# EAGLE design CX80 (EAGLE 6.3)
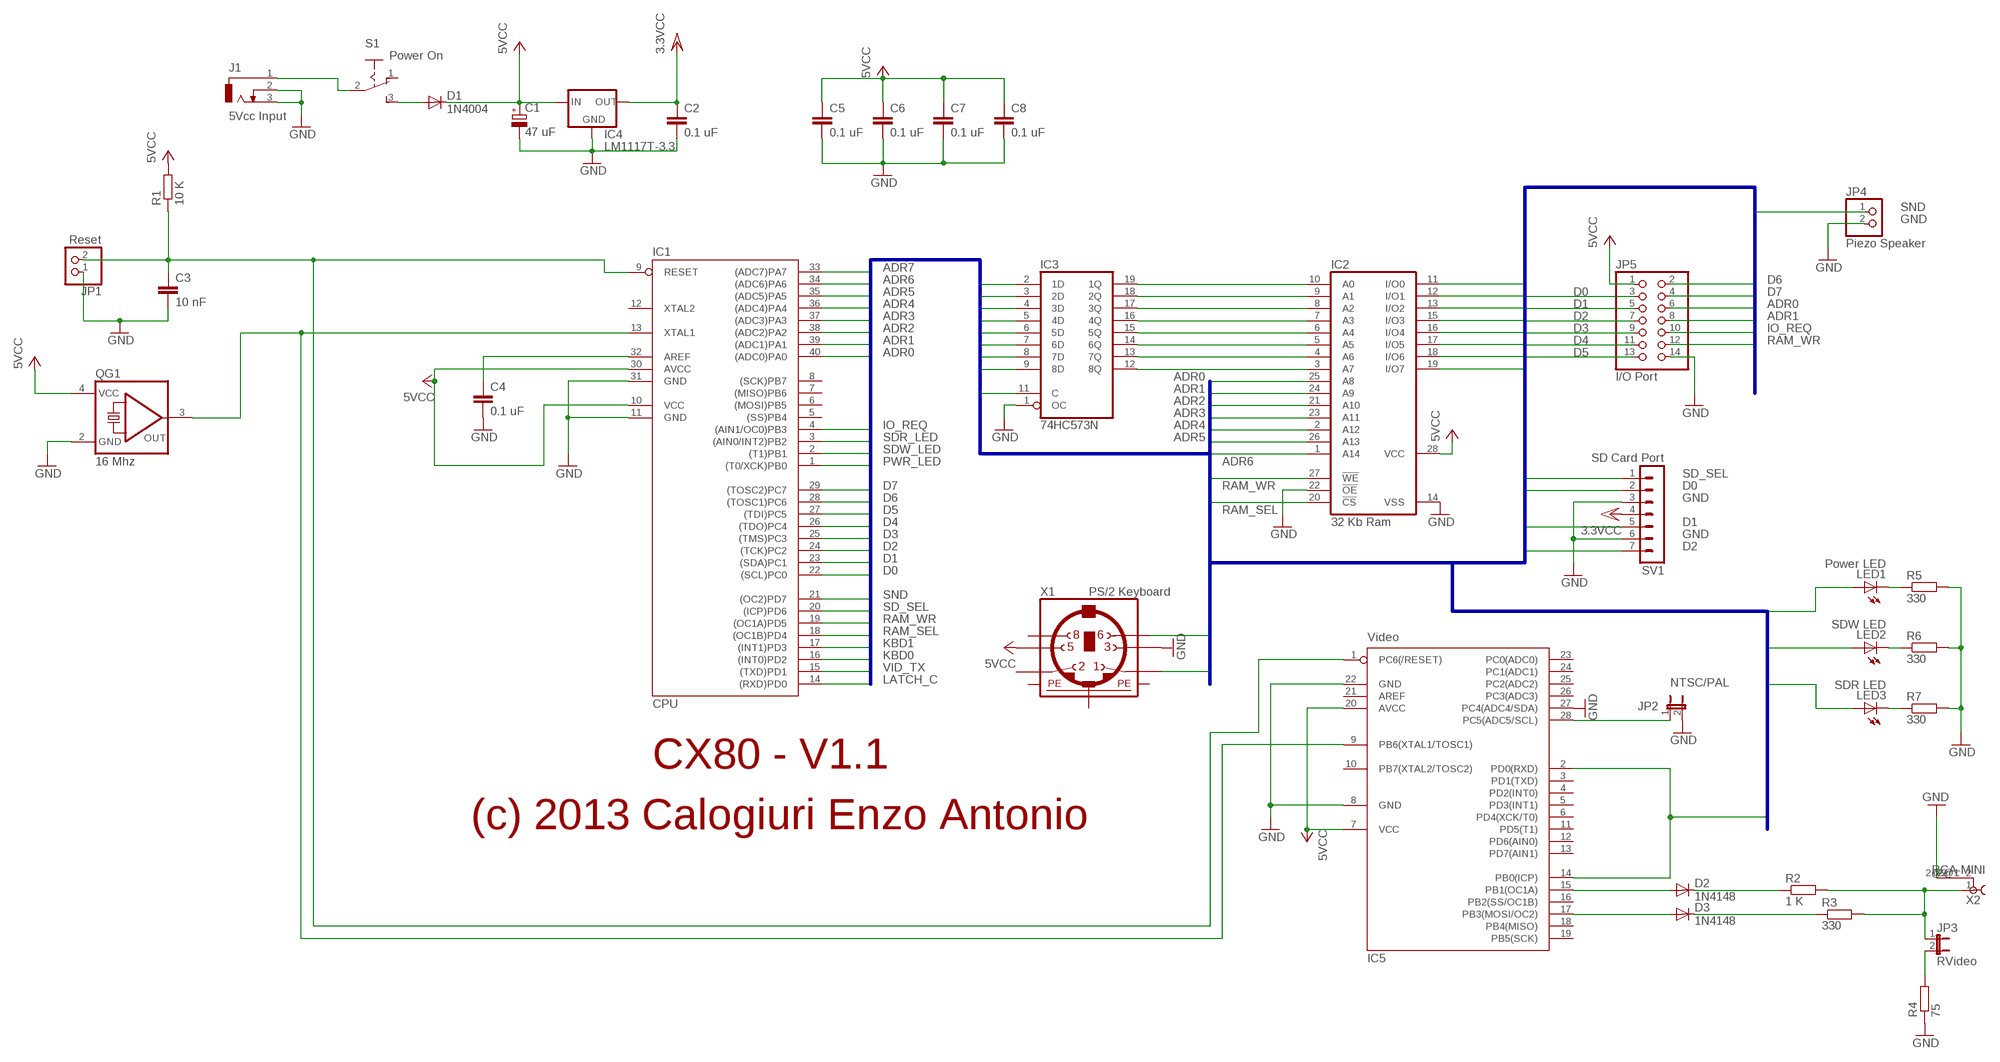
[diagram p0: schematic, sheet 1]

## Parts
C1  47 uF  CPOL-EUE2.5-5  [E2,5-5]
C2  0.1 uF  C-EU050-030X075  [C050-030X075]
C3  10 nF  C-EU050-030X075  [C050-030X075]
C4  0.1 uF  C-EU050-030X075  [C050-030X075]
C5  0.1 uF  C-EU050-030X075  [C050-030X075]
C6  0.1 uF  C-EU050-030X075  [C050-030X075]
C7  0.1 uF  C-EU050-030X075  [C050-030X075]
C8  0.1 uF  C-EU050-030X075  [C050-030X075]
D1  1N4004  [DO41-10]
D2  1N4148  1N4148DO35-10  [DO35-10]
D3  1N4148  1N4148DO35-10  [DO35-10]
IC1  CPU  MEGA32-P  [DIL40]
IC2  32 Kb Ram  62832P  [DIL28-3]
IC3  74HC573N  [DIL20]
IC4  LM1117T-3.3  [TO220]
IC5  Video  MEGA8-P  [DIL28-3]
J1  5Vcc Input  DCJ0303  [DCJ0303]
JP1  Reset  PINHD-1X2  [1X02]
JP2  NTSC/PAL  JP1E  [JP1]
JP3  RVideo  JP1E  [JP1]
JP4  Piezo Speaker  PINHD-1X2  [1X02]
JP5  I/O Port  PINHD-2X7  [2X07]
LED1  Power LED  LED3MM  [LED3MM]
LED2  SDW LED  LED3MM  [LED3MM]
LED3  SDR LED  LED3MM  [LED3MM]
QG1  16 Mhz  SG531  [DIL08-4]
R1  10 K  R-EU_0207/10  [0207/10]
R2  1 K  R-EU_0207/10  [0207/10]
R3  330  R-EU_0207/10  [0207/10]
R4  75  R-EU_0207/10  [0207/10]
R5  330  R-EU_0207/10  [0207/10]
R6  330  R-EU_0207/10  [0207/10]
R7  330  R-EU_0207/10  [0207/10]
S1  Power On  255SB  [255SB]
SV1  SD Card Port  MA07-1  [MA07-1]
X1  PS/2 Keyboard  MINI_DIN_6  [M_DIN6]
X2  RCA-MINI  [RCA-MINI]

## Nets
ADR0: IC1.40((ADC0)PA0) IC2.25(A8) IC3.2(1D) JP5.6
ADR1: IC1.39((ADC1)PA1) IC2.24(A9) IC3.3(2D) JP5.8
ADR2: IC1.38((ADC2)PA2) IC2.21(A10) IC3.4(3D)
ADR3: IC1.37((ADC3)PA3) IC2.23(A11) IC3.5(4D)
ADR4: IC1.36((ADC4)PA4) IC2.2(A12) IC3.6(5D)
ADR5: IC1.35((ADC5)PA5) IC2.26(A13) IC3.7(6D)
ADR6: IC1.34((ADC6)PA6) IC2.1(A14) IC3.8(7D)
ADR7: IC1.33((ADC7)PA7) IC3.9(8D)
D0: IC1.22((SCL)PC0) IC2.11(I/O0) JP5.3 SV1.2
D1: IC1.23((SDA)PC1) IC2.12(I/O1) JP5.5 SV1.5
D2: IC1.24((TCK)PC2) IC2.13(I/O2) JP5.7 SV1.7
D3: IC1.25((TMS)PC3) IC2.15(I/O3) JP5.9
D4: IC1.26((TDO)PC4) IC2.16(I/O4) JP5.11
D5: IC1.27((TDI)PC5) IC2.17(I/O5) JP5.13
D6: IC1.28((TOSC1)PC6) IC2.18(I/O6) JP5.2
D7: IC1.29((TOSC2)PC7) IC2.19(I/O7) JP5.4
GND: C1.- C2.2 C3.2 C4.2 C5.2 C6.2 C7.2 C8.2 IC1.11(GND) IC1.31(GND) IC2.14(VSS) IC2.22(!OE) IC3.1(OC) IC4.1(GND) IC5.8(GND) IC5.22(GND) IC5.27(PC4(ADC4/SDA)) J1.2 J1.3 JP1.1 JP2.2 JP4.2 JP5.14 QG1.2(GND) R4.1 R5.2 R6.2 R7.2 SV1.3 SV1.6 X1.3 X2.2@2
IO_REQ: IC1.4((AIN1/OC0)PB3) JP5.10
KBD0: IC1.16((INT0)PD2) X1.6
KBD1: IC1.17((INT1)PD3) X1.1
LATCH_C: IC1.14((RXD)PD0) IC3.11(C)
N$1: D1.A S1.3(S)
N$2: IC2.10(A0) IC3.19(1Q)
N$3: C3.1 IC1.9(RESET) IC5.1(PC6(/RESET)) JP1.2 R1.1
N$4: IC2.9(A1) IC3.18(2Q)
N$5: IC1.13(XTAL1) IC5.9(PB6(XTAL1/TOSC1)) QG1.3(OUT)
N$6: C4.1 IC1.32(AREF)
N$7: IC2.8(A2) IC3.17(3Q)
N$8: IC2.7(A3) IC3.16(4Q)
N$9: IC2.6(A4) IC3.15(5Q)
N$10: IC2.5(A5) IC3.14(6Q)
N$11: IC2.4(A6) IC3.13(7Q)
N$12: IC2.3(A7) IC3.12(8Q)
N$13: IC5.28(PC5(ADC5/SCL)) JP2.1
N$14: D2.A IC5.15(PB1(OC1A))
N$15: D2.C R2.1
N$16: D3.A IC5.17(PB3(MOSI/OC2))
N$17: D3.C R3.1
N$18: JP3.1 R2.2 R3.2 X2.1
N$19: JP3.2 R4.2
N$20: J1.1 S1.2(P)
N$21: LED1.K(C) R5.1
N$22: LED2.K(C) R6.1
N$23: LED3.K(C) R7.1
PWR_LED: IC1.1((T0/XCK)PB0) LED1.A
RAM_SEL: IC1.18((OC1B)PD4) IC2.20(!CS)
RAM_WR: IC1.19((OC1A)PD5) IC2.27(!WE) JP5.12
SD_SEL: IC1.20((ICP)PD6) SV1.1
SDR_LED: IC1.3((AIN0/INT2)PB2) LED3.A
SDW_LED: IC1.2((T1)PB1) LED2.A
SND: IC1.21((OC2)PD7) JP4.1
VCC: C1.+ C5.1 C6.1 C7.1 C8.1 D1.C IC1.10(VCC) IC1.30(AVCC) IC2.28(VCC) IC4.3(IN) IC5.7(VCC) IC5.20(AVCC) JP5.1 QG1.4(VCC) R1.2 X1.5 ; supply symbol labelled 5VCC
VCC/2: C2.1 IC4.2(OUT) SV1.4 ; supply symbol labelled 3.3VCC
VID_TX: IC1.15((TXD)PD1) IC5.2(PD0(RXD)) IC5.14(PB0(ICP))
Unconnected: IC1.5((SS)PB4) IC1.6((MOSI)PB5) IC1.7((MISO)PB6) IC1.8((SCK)PB7) IC1.12(XTAL2) IC5.3(PD1(TXD)) IC5.4(PD2(INT0)) IC5.5(PD3(INT1)) IC5.6(PD4(XCK/T0)) IC5.10(PB7(XTAL2/TOSC2)) IC5.11(PD5(T1)) IC5.12(PD6(AIN0)) IC5.13(PD7(AIN1)) IC5.16(PB2(SS/OC1B)) IC5.18(PB4(MISO)) IC5.19(PB5(SCK)) IC5.21(AREF) IC5.23(PC0(ADC0)) IC5.24(PC1(ADC1)) IC5.25(PC2(ADC2)) IC5.26(PC3(ADC3)) S1.1(O) X1.2 X1.8 X2.2 X2.2@1

## Buses
ADR[0..7],D[0..7],LATCH_C,RAM_SEL,RAM_WR,SD_SEL,KBD0,KBD1,VID_TX,PWR_LED,SDW_LED,SDR_LED,SND,IO_REQ

## Notes on the sheet
- CX80 - V1.1
- (c) 2013 Calogiuri Enzo Antonio

## Power pins joined to a net without a drawn wire
GND: IC3.10(GND)
PE1: X1.SH1(PE1)
PE2: X1.SH2(PE2)
PE3: X1.SH3(PE3)
VCC: IC3.20(VCC)

## Library data of the parts
C1 = resistor:CPOL-EU: POLARIZED CAPACITOR, European symbol
C2-C8 = resistor:C-EU: CAPACITOR, European symbol
D1 = diode:1N4004: DIODE general purpose rectifier, 1 A
D2 D3 = diode:1N4148: DIODE high speed (Philips)
IC1 = atmel:MEGA32-P: MICROCONTROLLER 32 Kbytes FLASH 2 Kbytes SRAM 1 Kbytes EEPROM USART 8-channel 10 bit ADC Source: www.atmel.com .. doc2503.pdf; MPN: ATMEGA32-16PU; OC_FARNELL: 1661729; OC_NEWARK: 51P1794
IC2 = memory-hitachi:62832P: MEMORY; OC_FARNELL: unknown; OC_NEWARK: unknown
IC3 = 74xx-us:74*573: 8-bit D latch BUS DRIVER
IC4 = lm1117:LM1117T-*
IC5 = atmel:MEGA8-P: MICROCONTROLLER 8 Kbytes FLASH, 1 kbytes SRAM, 512 bytes EEPROM, USART, 4-channel 10 bit ADC, 2-channel 8 bit ADC Pin compatible with Atmega48, ATMega88, ATMega168 Source: avr.lbr; OC_FARNELL: unknown; OC_NEWARK: unknown
J1 = con-jack-GK1_3:DCJ0303: DC POWER JACK - GK1.3; OC_FARNELL: unknown; OC_NEWARK: unknown
JP1 JP4 = pinhead:PINHD-1X2: PIN HEADER
JP2 JP3 = jumper:JP1E: JUMPER
JP5 = pinhead:PINHD-2X7: PIN HEADER
LED1-LED3 = led:LED: LED OSRAM: - CHIPLED LG R971, LG N971, LY N971, LG Q971, LY Q971, LO R971, LY R971 LH N974, LH R974 LS Q976, LO Q976, LY Q976 LO Q996 - Hyper CHIPLED LW Q18S LB Q993, LB Q99A, LB R99A - SideLED LS A670, LO A670, LY A670, LG A670, LP A670 LB A673, LV A673, LT A673, LW A673 LH A674 LY A675 LS A676, LA A676, LO A676, LY A676, LW A676 LS A679, LY A679, LG A679 - Hyper Micro SIDELED® LS Y876, LA Y876, LO Y876, LY Y876 LT Y87S - SmartLED LW L88C, LW L88S LB L89C, LB L89S, LG L890 LS L89K, LO L89K, LY L89K LS L896, LA L896, LO L896, LY L896 - TOPLED LS T670, LO T670, LY T670, LG T670, LP T670 LSG T670, LSP T670, LSY T670, LOP T670, LYG T670 LG T671, LOG T671, LSG T671 LB T673, LV T673, LT T673, LW T673 LH T674 LS T676, LA T676, LO T676, LY T676, LB T676, LH T676, LSB T676, LW T676 LB T67C, LV T67C, LT T67C, LS T67K, LO T67K, LY T67K, LW E67C LS E67B, LA E67B, LO E67B, LY E67B, LB E67C, LV E67C, LT E67C LW T67C LS T679, LY T679, LG T679 LS T770, LO T770, LY T770, LG T770, LP T770 LB T773, LV T773, LT T773, LW T773 LH T774 LS E675, LA E675, LY E675, LS T675 LS T776, LA T776, LO T776, LY T776, LB T776 LHGB T686 LT T68C, LB T68C - Hyper Mini TOPLED® LB M676 - Mini TOPLED Santana® LG M470 LS M47K, LO M47K, LY M47K Source: http://www.osram.convergy.de LUXEON: - LUMILED® LXK2-PW12-R00, LXK2-PW12-S00, LXK2-PW14-U00, LXK2-PW14-V00 LXK2-PM12-R00, LXK2-PM12-S00, LXK2-PM14-U00 LXK2-PE12-Q00, LXK2-PE12-R00, LXK2-PE12-S00, LXK2-PE14-T00, LXK2-PE14-U00 LXK2-PB12-K00, LXK2-PB12-L00, LXK2-PB12-M00, LXK2-PB14-N00, LXK2-PB14-P00, LXK2-PB14-Q00 LXK2-PR12-L00, LXK2-PR12-M00, LXK2-PR14-Q00, LXK2-PR14-R00 LXK2-PD12-Q00, LXK2-PD12-R00, LXK2-PD12-S00 LXK2-PH12-R00, LXK2-PH12-S00 LXK2-PL12-P00, LXK2-PL12-Q00, LXK2-PL12-R00 Source: www.luxeon.com KINGBRIGHT: KA-3528ASYC Source: www.kingbright.com
QG1 = crystal:SG531: CRYSTAL RESONATOR; MPN: SG531P16MHZ; OC_FARNELL: unknown; OC_NEWARK: 01M8837
R1-R7 = resistor:R-EU_: RESISTOR, European symbol
S1 = switch:255SB: SLIDING SWITCH Distributor Buerklin, 11G810
SV1 = con-lstb:MA07-1: PIN HEADER; OC_FARNELL: unknown; OC_NEWARK: unknown
X1 = mini_din:MINI_DIN_6
X2 = Rca-Mini:RCA-MINI: Female Cinch CONNECTOR ( RCA Jack ); MF: FARNELL; MPN: TOBU 3; OC_FARNELL: 592791; OC_NEWARK: 06WX5914

## Board
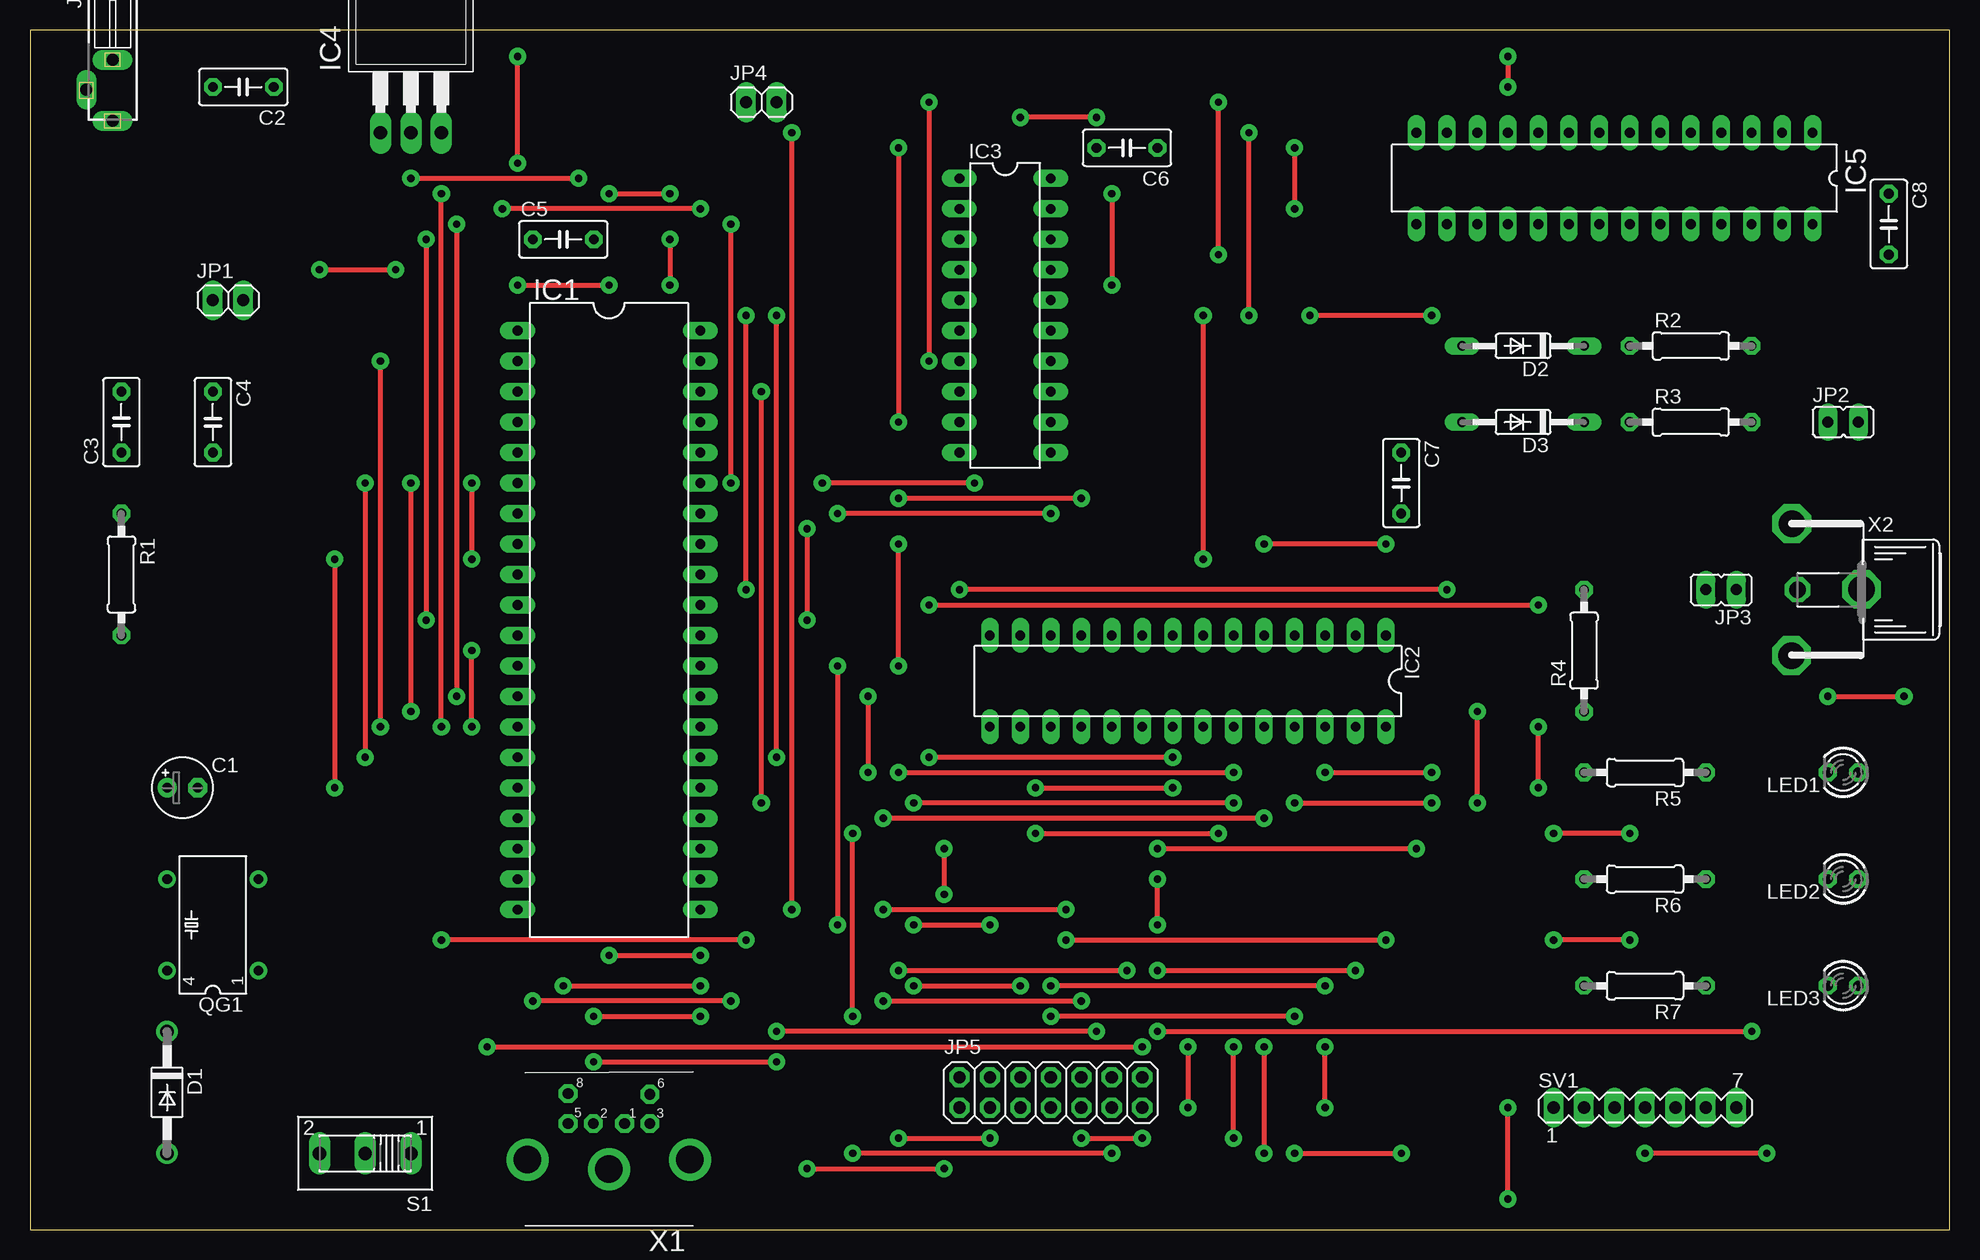
[diagram p1: board, top side]
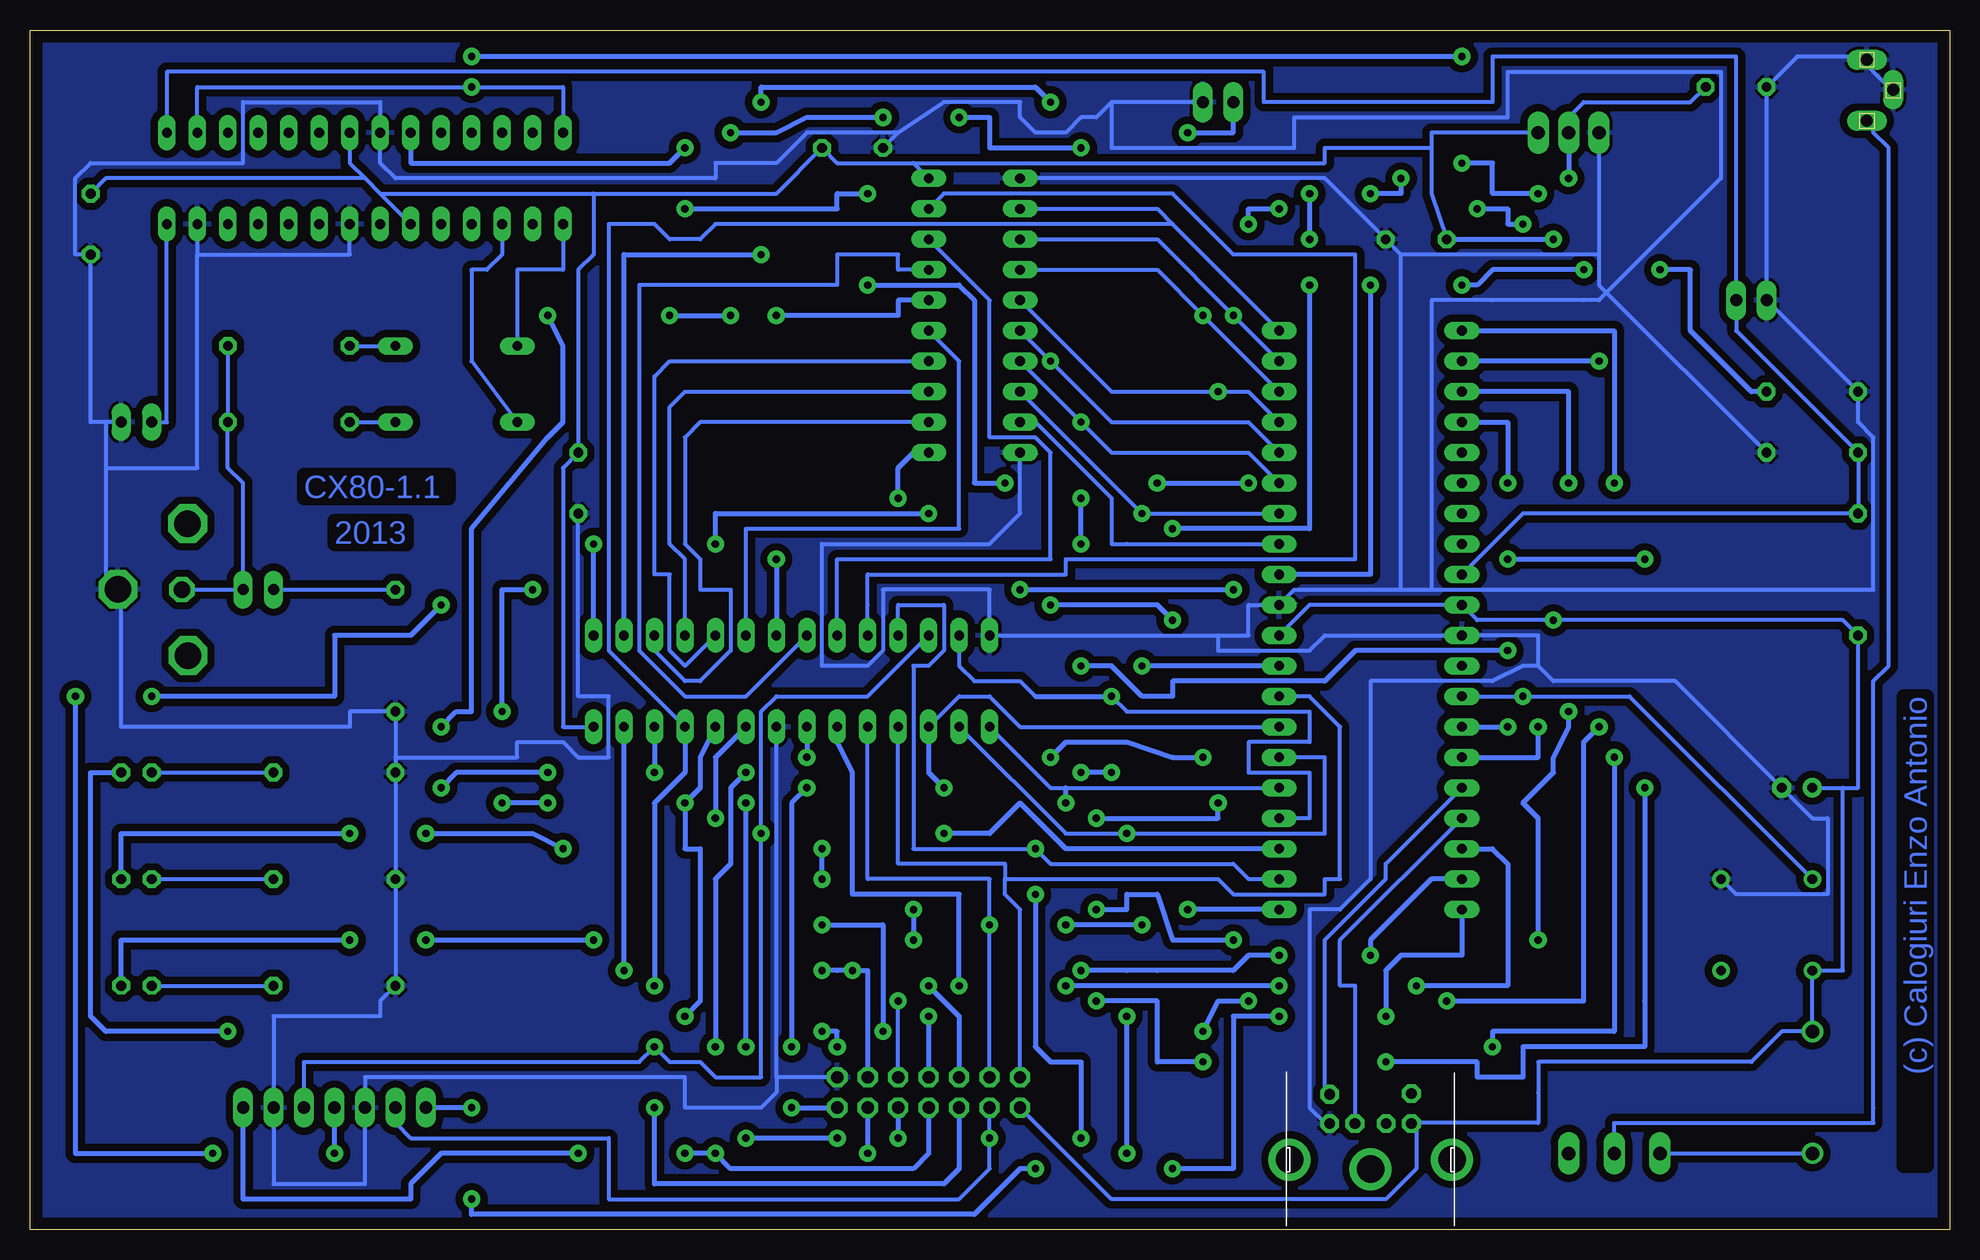
[diagram p2: board, bottom side, seen from below]

Size 160 x 100 mm. Coordinates in mm from the lower left corner, seen from the top.
Outline: 0,0 160,0 160,100 0,100 0,0
Copper layers (1*16): Top 0.035mm / dielectric 1.5mm / Bottom 0.035mm
Design rules "default *": minimum track width 13mil, minimum drill 24mil, track to track 13mil, track to pad 13mil, pad to pad 13mil, via to via 13mil, smd to smd 8mil, copper to edge 40mil, drill to drill 8mil, minimum pad ring 13mil, minimum via ring 10mil, stop-mask expansion 4mil, vias tented up to drill 0mil, thermal gap 10mil

### Footprints (pad centres in the part's own frame; a part is rotated, then mirrored left to right if it is on the bottom)
E2,5-5 = drill 0.813 pad 1.6: + -1.27,0 | drill 0.813 pad 1.6 octagon: - 1.27,0
C050-030X075 = drill 0.813 octagon: 1 -2.54,0; 2 2.54,0
DO41-10 = drill 1.118: A 5.08,0; C -5.08,0
DO35-10 = drill 0.813 long: A 5.08,0; C -5.08,0
DIL40 = drill 0.813 long: 1 -24.13,-7.62; 2 -21.59,-7.62; 3 -19.05,-7.62; 4 -16.51,-7.62; 5 -13.97,-7.62; 6 -11.43,-7.62; 7 -8.89,-7.62; 8 -6.35,-7.62; 9 -3.81,-7.62; 10 -1.27,-7.62; 11 1.27,-7.62; 12 3.81,-7.62; 13 6.35,-7.62; 14 8.89,-7.62; 15 11.43,-7.62; 16 13.97,-7.62; 17 16.51,-7.62; 18 19.05,-7.62; 19 21.59,-7.62; 20 24.13,-7.62; 21 24.13,7.62; 22 21.59,7.62; 23 19.05,7.62; 24 16.51,7.62; 25 13.97,7.62; 26 11.43,7.62; 27 8.89,7.62; 28 6.35,7.62; 29 3.81,7.62; 30 1.27,7.62; 31 -1.27,7.62; 32 -3.81,7.62; 33 -6.35,7.62; 34 -8.89,7.62; 35 -11.43,7.62; 36 -13.97,7.62; 37 -16.51,7.62; 38 -19.05,7.62; 39 -21.59,7.62; 40 -24.13,7.62
DIL28-3 = drill 0.813 long: 1 -16.51,-3.81; 2 -13.97,-3.81; 3 -11.43,-3.81; 4 -8.89,-3.81; 5 -6.35,-3.81; 6 -3.81,-3.81; 7 -1.27,-3.81; 8 1.27,-3.81; 9 3.81,-3.81; 10 6.35,-3.81; 11 8.89,-3.81; 12 11.43,-3.81; 13 13.97,-3.81; 14 16.51,-3.81; 15 16.51,3.81; 16 13.97,3.81; 17 11.43,3.81; 18 8.89,3.81; 19 6.35,3.81; 20 3.81,3.81; 21 1.27,3.81; 22 -1.27,3.81; 23 -3.81,3.81; 24 -6.35,3.81; 25 -8.89,3.81; 26 -11.43,3.81; 27 -13.97,3.81; 28 -16.51,3.81
DIL20 = drill 0.813 long: 1 -11.43,-3.81; 2 -8.89,-3.81; 3 -6.35,-3.81; 4 -3.81,-3.81; 5 -1.27,-3.81; 6 1.27,-3.81; 7 3.81,-3.81; 8 6.35,-3.81; 9 8.89,-3.81; 10 11.43,-3.81; 11 11.43,3.81; 12 8.89,3.81; 13 6.35,3.81; 14 3.81,3.81; 15 1.27,3.81; 16 -1.27,3.81; 17 -3.81,3.81; 18 -6.35,3.81; 19 -8.89,3.81; 20 -11.43,3.81
TO220 = drill 1.118 long: 1 -2.54,-6.35; 2 0,-6.35; 3 2.54,-6.35
DCJ0303 = drill 1 pad 1.27 long: 1 2,4.1; 2 4.2,1.5; 3 2,-1
1X02 = drill 1.016 long: 1 -1.27,0; 2 1.27,0
JP1 = drill 0.914 long: 1 0,-1.27; 2 0,1.27
2X07 = drill 1.016 octagon: 1 -7.62,-1.27; 2 -7.62,1.27; 3 -5.08,-1.27; 4 -5.08,1.27; 5 -2.54,-1.27; 6 -2.54,1.27; 7 0,-1.27; 8 0,1.27; 9 2.54,-1.27; 10 2.54,1.27; 11 5.08,-1.27; 12 5.08,1.27; 13 7.62,-1.27; 14 7.62,1.27
LED3MM = drill 0.813 octagon: A -1.27,0; K 1.27,0
DIL08-4 = drill 0.813: 1 -3.81,-3.81; 2 3.81,-3.81; 3 3.81,3.81; 4 -3.81,3.81
0207/10 = drill 0.813 octagon: 1 -5.08,0; 2 5.08,0
255SB = drill 1.118 long: 1 -3.81,0; 2 0,0; 3 3.81,0
MA07-1 = drill 1.016 long: 1 -7.62,0; 2 -5.08,0; 3 -2.54,0; 4 0,0; 5 2.54,0; 6 5.08,0; 7 7.62,0
M_DIN6 = drill 0.9 pad 1.422 octagon: 1 -1.3,-3.75; 2 1.3,-3.75; 3 -3.4,-3.75; 5 3.4,-3.75; 6 -3.4,-6.2; 8 3.4,-6.25 | drill 2.3 pad 3.5: SH1 6.8,-0.75; SH2 0,0.05; SH3 -6.75,-0.75
RCA-MINI = drill 1.397 octagon: 1 0,0.01 | drill 2.21 octagon: 2 5.488,-0.49; 2@1 -5.513,-0.465; 2@2 -0.025,5.355

### Placement (x,y rotation side)
C1  12.7,36.83 0 top
C2  17.78,95.25 180 top
C3  7.62,67.31 90 top
C4  15.24,67.31 270 top
C5  44.45,82.55 0 top
C6  91.44,90.17 180 top
C7  114.3,62.23 270 top
C8  154.94,83.82 270 top
D1  11.43,11.43 270 top
D2  124.46,73.66 180 top
D3  124.46,67.31 180 top
IC1  48.26,50.8 270 top
IC2  96.52,45.72 180 top
IC3  81.28,76.2 270 top
IC4  31.75,97.79 0 top
IC5  132.08,87.63 180 top
J1  8.89,96.52 180 top
JP1  16.51,77.47 0 top
JP2  151.13,67.31 270 top
JP3  140.97,53.34 90 top
JP4  60.96,93.98 0 top
JP5  85.09,11.43 0 top
LED1  151.13,38.1 180 top
LED2  151.13,29.21 180 top
LED3  151.13,20.32 180 top
QG1  15.24,25.4 90 top
R1  7.62,54.61 270 top
R2  138.43,73.66 0 top
R3  138.43,67.31 0 top
R4  129.54,48.26 90 top
R5  134.62,38.1 180 top
R6  134.62,29.21 180 top
R7  134.62,20.32 180 top
S1  27.94,6.35 180 top
SV1  134.62,10.16 0 top
X1  48.26,5.08 180 top
X2  147.32,53.34 270 top

### Tracks (layer width: path | path; a pad name or v marks a point on that pad's centre or on a via)
ADR0  (via drill 0.6 pad 1.42)
  Top 0.406: v107.95,20.32 v85.09,20.32
  Bottom 0.33: 64.77,83.82 66.04,85.09 IC3.2 | 64.77,83.82 IC1.40 | IC2.25 111.76,48.26 111.76,83.82 107.95,83.82 106.68,82.55 104.14,82.55 102.87,83.82 64.77,83.82
  Bottom 0.406: IC2.25 105.41,38.1 107.95,35.56 v107.95,20.32 | v85.09,20.32 82.55,17.78 JP5.6
ADR1  (via drill 0.6 pad 1.42)
  Top 0.406: v105.41,17.78 v85.09,17.78 | v105.41,35.56 v116.84,35.56 | v120.65,35.56 v120.65,43.18 | v118.11,53.34 v77.47,53.34 | v59.69,53.34 v59.69,76.2
  Bottom 0.33: IC1.39 v59.69,76.2 66.04,82.55 IC3.3
  Bottom 0.406: v105.41,17.78 104.14,19.05 104.14,31.75 105.41,31.75 v105.41,35.56 104.14,36.83 104.14,39.37 IC2.24 | v85.09,17.78 JP5.8 | v116.84,35.56 v120.65,35.56 | v120.65,43.18 120.65,53.34 v118.11,53.34 | v77.47,53.34 v59.69,53.34
ADR2  (via drill 0.6 pad 1.42)
  Top 0.406: v95.25,39.37 v74.93,39.37 | v62.23,39.37 v62.23,76.2
  Bottom 0.33: IC1.38 v62.23,76.2 66.04,80.01 IC3.4
  Bottom 0.406: IC2.21 v95.25,39.37 | v74.93,39.37 73.66,40.64 68.58,40.64 64.77,39.37 v62.23,39.37
ADR3  (via drill 0.6 pad 1.42)
  Top 0.406: v102.87,34.29 v71.12,34.29 | v60.96,35.56 v60.96,69.85
  Bottom 0.33: IC1.37 58.42,69.85 v60.96,69.85 69.85,69.85 IC3.5
  Bottom 0.406: IC2.23 102.87,39.37 v102.87,34.29 | v71.12,34.29 60.96,34.29 v60.96,35.56
ADR4  (via drill 0.6 pad 1.42)
  Top 0.406: v99.06,81.28 v99.06,93.98 | v74.93,93.98 v74.93,72.39
  Bottom 0.33: IC1.36 58.42,67.31 69.85,67.31 v74.93,72.39 IC3.6
  Bottom 0.406: IC2.2 110.49,81.28 v99.06,81.28 | v99.06,93.98 99.06,95.25 76.2,95.25 v74.93,93.98
ADR5  (via drill 0.6 pad 1.42)
  Top 0.406: v107.95,38.1 v116.84,38.1 | v125.73,36.83 v125.73,41.91 | v116.84,76.2 v106.68,76.2 | v101.6,76.2 v101.6,91.44 | v88.9,92.71 v82.55,92.71 | v72.39,90.17 v72.39,67.31
  Bottom 0.33: IC1.35 58.42,64.77 69.85,64.77 v72.39,67.31 IC3.7
  Bottom 0.406: IC2.26 v107.95,38.1 | v116.84,38.1 124.46,38.1 v125.73,36.83 | v125.73,41.91 124.46,43.18 123.19,43.18 123.19,58.42 116.84,66.04 115.57,67.31 115.57,73.66 v116.84,76.2 | v106.68,76.2 v101.6,76.2 | v101.6,91.44 97.79,91.44 95.25,92.71 v88.9,92.71 | v82.55,92.71 80.01,92.71 80.01,90.17 v72.39,90.17
ADR6  (via drill 0.6 pad 1.42)
  Top 0.406: v113.03,57.15 v102.87,57.15 | v85.09,59.69 v67.31,59.69
  Bottom 0.33: IC1.34 v67.31,59.69 IC3.8
  Bottom 0.406: IC2.1 v113.03,57.15 | v102.87,57.15 102.87,59.69 v85.09,59.69
ADR7
  Bottom 0.33: IC1.33 68.58,57.15 69.85,57.15 69.85,60.96 76.2,67.31 IC3.9
D0  (via drill 0.6 pad 1.42)
  Top 0.406: v76.2,31.75 v76.2,27.94 | v72.39,7.62 v80.01,7.62
  Bottom 0.33: JP5.3 v80.01,7.62 80.01,5.08 82.55,2.54 111.76,2.54 111.76,7.62 128.27,7.62 129.54,8.89 SV1.2 | IC1.22 58.42,29.21 59.69,30.48 74.93,30.48 v76.2,31.75 86.36,31.75 86.36,46.99 85.09,46.99 83.82,48.26 83.82,52.07 87.63,52.07 IC2.11
  Bottom 0.406: v76.2,27.94 76.2,15.24 74.93,13.97 72.39,13.97 v72.39,7.62
D1  (via drill 0.6 pad 1.42)
  Top 0.406: v107.95,10.16 v107.95,15.24 | v83.82,33.02 v99.06,33.02
  Bottom 0.33: IC2.12 90.17,44.45 97.79,44.45 99.06,43.18 v99.06,33.02 99.06,12.7 102.87,12.7 104.14,13.97 106.68,13.97 v107.95,15.24 109.22,13.97 137.16,13.97 SV1.5
  Bottom 0.406: JP5.5 82.55,5.08 83.82,3.81 107.95,3.81 v107.95,10.16 | IC1.23 73.66,31.75 77.47,35.56 80.01,33.02 v83.82,33.02
D2  (via drill 0.6 pad 1.42)
  Top 0.406: v105.41,6.35 v114.3,6.35 | v69.85,44.45 v69.85,38.1 | v72.39,38.1 v100.33,38.1 | v102.87,15.24 v102.87,6.35
  Bottom 0.33: IC1.24 53.34,34.29 53.34,38.1 58.42,38.1 58.42,40.64 53.34,40.64 53.34,43.18 68.58,43.18 v69.85,44.45 | IC2.13 82.55,46.99 81.28,45.72 77.47,45.72 76.2,44.45
  Bottom 0.406: JP5.7 85.09,6.35 86.36,5.08 101.6,5.08 v102.87,6.35 v105.41,6.35 | v114.3,6.35 125.73,6.35 128.27,3.81 128.27,2.54 142.24,2.54 SV1.7 | 76.2,44.45 v69.85,44.45 | v69.85,38.1 v72.39,38.1 | v100.33,38.1 101.6,36.83 101.6,30.48 102.87,29.21 v102.87,15.24
D3  (via drill 0.6 pad 1.42)
  Top 0.406: v87.63,7.62 v92.71,7.62 | v100.33,7.62 v100.33,15.24 | v100.33,35.56 v73.66,35.56
  Bottom 0.33: IC1.25 73.66,36.83 74.93,36.83 IC2.15
  Bottom 0.406: JP5.9 v87.63,7.62 | v92.71,7.62 v100.33,7.62 | v100.33,15.24 v100.33,35.56 | v73.66,35.56 73.66,36.83
D4  (via drill 0.6 pad 1.42)
  Top 0.406: v90.17,6.35 v68.58,6.35 | v68.58,17.78 v68.58,33.02
  Bottom 0.33: IC1.26 52.07,39.37 52.07,33.02 v68.58,33.02 73.66,33.02 IC2.16
  Bottom 0.406: JP5.11 v90.17,6.35 | v68.58,6.35 v68.58,17.78
D5  (via drill 0.6 pad 1.42)
  Top 0.406: v83.82,36.83 v95.25,36.83 | v96.52,15.24 v96.52,10.16
  Bottom 0.33: IC1.27 77.47,41.91 80.01,44.45 82.55,44.45 IC2.17
  Bottom 0.406: IC2.17 85.09,38.1 v83.82,36.83 | v95.25,36.83 96.52,35.56 v96.52,15.24 | v96.52,10.16 JP5.13
D6
  Bottom 0.33: JP5.2 77.47,26.67 78.74,27.94 78.74,29.21 | IC2.18 87.63,30.48 78.74,30.48 78.74,29.21 | IC1.28 53.34,44.45 50.8,41.91 50.8,29.21 52.07,29.21 52.07,27.94 59.69,27.94 60.96,29.21 78.74,29.21
D7  (via drill 0.6 pad 1.42)
  Top 0.406: v67.31,46.99 v67.31,25.4 | v73.66,25.4 v80.01,25.4
  Bottom 0.33: IC2.19 90.17,29.21 80.01,29.21 v80.01,25.4 JP5.4
  Bottom 0.406: IC1.29 v67.31,46.99 | v67.31,25.4 v73.66,25.4
GND
  Bottom 0.33: C4.2 29.21,78.74 29.21,81.28 | IC4.1 29.21,81.28 | 45.72,81.28 C5.2 52.07,87.63 IC3.1 | 29.21,81.28 45.72,81.28 | QG1.2 17.78,27.94 10.16,27.94 10.16,34.29 11.43,34.29 C1.- 22.86,45.72 33.02,45.72 34.29,46.99 | 34.29,46.99 34.29,49.53 IC1.11 52.07,49.53 53.34,48.26 60.96,48.26 60.96,49.53 | 34.29,46.99 35.56,46.99 38.1,45.72 48.26,45.72 48.26,29.21 50.8,26.67 53.34,26.67 53.34,10.16 52.07,8.89 X1.3 | 7.62,97.79 12.7,97.79 C2.2 JP1.1 C3.2 7.62,67.31 6.35,66.04 6.35,53.34 43.18,53.34 | 7.62,97.79 5.08,95.25 J1.2 | 7.62,97.79 J1.3 | 60.96,49.53 58.42,49.53 58.42,52.07 IC1.31 54.61,53.34 45.72,53.34 | 60.96,49.53 IC2.14 80.01,53.34 88.9,53.34 88.9,48.26 90.17,46.99 93.98,46.99 93.98,57.15 80.01,57.15 77.47,59.69 IC3.10 | 45.72,53.34 43.18,53.34 | 45.72,53.34 45.72,81.28 | 87.63,91.44 83.82,93.98 77.47,93.98 77.47,92.71 76.2,91.44 73.66,91.44 72.39,92.71 71.12,92.71 69.85,93.98 | 87.63,91.44 C6.2 | JP4.2 69.85,93.98 | 87.63,91.44 95.25,91.44 97.79,88.9 102.87,88.9 102.87,87.63 129.54,87.63 130.81,88.9 IC5.8 130.81,93.98 142.24,93.98 142.24,88.9 154.94,88.9 156.21,87.63 156.21,81.28 C8.2 154.94,67.31 153.67,67.31 | 97.79,12.7 IC2.22 | JP5.14 97.79,12.7 | 97.79,12.7 97.79,11.43 99.06,10.16 105.41,10.16 105.41,12.7 132.08,12.7 SV1.3 132.08,3.81 139.7,3.81 SV1.6 139.7,17.78 130.81,17.78 130.81,19.05 R7.2 R6.2 R5.2 129.54,39.37 | IC5.22 133.35,81.28 146.05,81.28 | IC5.27 146.05,81.28 | JP2.2 153.67,67.31 | 153.67,67.31 153.67,63.5 | 153.67,63.5 153.67,54.61 X2.2@2 152.4,53.34 152.4,41.91 133.35,41.91 133.35,43.18 R4.1 129.54,39.37 | 146.05,81.28 146.05,63.5 153.67,63.5
  Bottom 0.33: C7.2 114.3,44.45 111.76,44.45 111.76,39.37 114.3,39.37 115.57,40.64 119.38,40.64 119.38,39.37 129.54,39.37 | 43.18,53.34 43.18,77.47 38.1,77.47 30.48,77.47 29.21,77.47 19.05,87.63 19.05,96.52 36.83,96.52 36.83,92.71 54.61,92.71 54.61,90.17 69.85,90.17 69.85,93.98
  pour Bottom (isolate 0.61): 0,100.33 160.02,100.33 160.02,99.06 160.02,0 0,0
IO_REQ  (via drill 0.6 pad 1.42, 0.61 pad 1.42)
  Top 0.406: v36.83,62.23 v36.83,55.88 | v25.4,55.88 v25.4,36.83 | v46.99,13.97 v62.23,13.97 | v71.12,19.05 v87.63,19.05
  Bottom 0.33: JP5.10 v87.63,19.05
  Bottom 0.406: IC1.4 36.83,67.31 v36.83,62.23 | v36.83,55.88 v25.4,55.88 | v25.4,36.83 25.4,19.05 25.4,15.24 35.56,15.24 35.56,13.97 35.56,12.7 39.37,12.7 39.37,13.97 v46.99,13.97 | v62.23,13.97 66.04,13.97 66.04,19.05 v71.12,19.05
KBD0
  Bottom 0.33: IC1.16 46.99,30.48 46.99,29.21 52.07,24.13 52.07,11.43 X1.6
KBD1
  Bottom 0.33: IC1.17 50.8,24.13 50.8,20.32 49.53,20.32 49.53,8.89 X1.1
LATCH_C  (via drill 0.6 pad 1.42)
  Top 0.406: v36.83,41.91 v36.83,48.26 | v72.39,46.99 v72.39,57.15 | v72.39,60.96 v87.63,60.96
  Bottom 0.406: IC1.14 v36.83,41.91 | v36.83,48.26 49.53,48.26 52.07,45.72 64.77,45.72 64.77,44.45 67.31,44.45 69.85,46.99 v72.39,46.99 | v72.39,57.15 v72.39,60.96 | v87.63,60.96 87.63,63.5 86.36,64.77 IC3.11
N$1
  Bottom 0.33: S1.3 D1.A
N$2
  Bottom 0.33: IC3.19 83.82,86.36 64.77,86.36 59.69,81.28 49.53,81.28 49.53,55.88 73.66,55.88 73.66,54.61 90.17,54.61 90.17,52.07 IC2.10
N$3
  Bottom 0.33: IC1.9 35.56,59.69 R1.1 C3.1 17.78,74.93 JP1.2 17.78,96.52 17.78,97.79 38.1,97.79 38.1,96.52 38.1,93.98 57.15,93.98 57.15,95.25 57.15,96.52 148.59,96.52 IC5.1
N$4
  Bottom 0.33: IC3.18 80.01,77.47 80.01,66.04 76.2,66.04 74.93,64.77 74.93,55.88 92.71,55.88 92.71,50.8 IC2.9
N$5  (via drill 0.6 pad 1.42)
  Top 0.406: v105.41,90.17 v105.41,85.09 | v90.17,86.36 v90.17,78.74 | v78.74,62.23 v66.04,62.23 | v58.42,62.23 v58.42,83.82 | v55.88,85.09 v39.37,85.09 | v35.56,83.82 v35.56,44.45
  Bottom 0.33: QG1.3 26.67,44.45 v35.56,44.45 IC1.13
  Bottom 0.406: IC5.9 128.27,88.9 106.68,88.9 v105.41,90.17 | v105.41,85.09 92.71,85.09 92.71,86.36 v90.17,86.36 | v90.17,78.74 82.55,78.74 81.28,77.47 81.28,62.23 v78.74,62.23 | v66.04,62.23 v58.42,62.23 | v58.42,83.82 58.42,85.09 v55.88,85.09 | v39.37,85.09 36.83,85.09 36.83,83.82 v35.56,83.82
N$6  (via drill 0.6 pad 1.42)
  Top 0.406: v24.13,80.01 v30.48,80.01 | v40.64,78.74 v48.26,78.74
  Bottom 0.406: C4.1 16.51,69.85 21.59,74.93 21.59,80.01 v24.13,80.01 | v30.48,80.01 38.1,80.01 39.37,78.74 v40.64,78.74 | v48.26,78.74 48.26,54.61 IC1.32
N$7
  Bottom 0.33: IC2.8 100.33,44.45 105.41,44.45 109.22,48.26 109.22,78.74 92.71,78.74 92.71,81.28 87.63,81.28 87.63,80.01 IC3.17
N$8  (via drill 0.6 pad 1.42)
  Top 0.406: v97.79,76.2 v97.79,55.88
  Bottom 0.406: IC3.16 87.63,77.47 87.63,76.2 v97.79,76.2 | v97.79,55.88 IC2.7
N$9
  Bottom 0.33: IC3.15 82.55,72.39 82.55,58.42 100.33,58.42 IC2.6
N$10
  Bottom 0.33: IC3.14 106.68,72.39 107.95,71.12 107.95,54.61 106.68,54.61 106.68,48.26 105.41,46.99 IC2.5
N$11
  Bottom 0.33: IC2.4 105.41,55.88 106.68,57.15 106.68,68.58 105.41,69.85 IC3.13
N$12
  Bottom 0.33: IC2.3 107.95,48.26 105.41,45.72 104.14,45.72 101.6,48.26 101.6,53.34 104.14,53.34 104.14,55.88 105.41,57.15 105.41,66.04 104.14,67.31 IC3.12
N$13
  Bottom 0.33: IC5.28 148.59,67.31 JP2.1
N$14
  Bottom 0.33: D2.A 119.38,80.01 115.57,80.01 IC5.15
N$15
  Bottom 0.33: R2.1 D2.C
N$16
  Bottom 0.33: D3.A 123.19,72.39 123.19,80.01 121.92,80.01 120.65,81.28 IC5.17
N$17
  Bottom 0.33: R3.1 D3.C
N$18
  Bottom 0.33: R2.2 R3.2 143.51,63.5 142.24,62.23 JP3.1 X2.1
N$19
  Bottom 0.33: JP3.2 R4.2
N$20
  Bottom 0.33: S1.2 27.94,8.89 6.35,8.89 6.35,10.16 6.35,45.72 5.08,46.99 5.08,66.04 5.08,67.31 5.08,90.17 6.35,91.44 6.35,92.71 J1.1
N$21
  Bottom 0.33: LED1.K R5.1
N$22
  Bottom 0.33: LED2.K R6.1
N$23
  Bottom 0.33: LED3.K R7.1
PWR_LED  (via drill 0.6 pad 1.42)
  Top 0.406: v27.94,62.23 v27.94,39.37 | v38.1,15.24 v92.71,15.24 | v93.98,16.51 v143.51,16.51
  Bottom 0.406: IC1.1 27.94,74.93 v27.94,62.23 | v27.94,39.37 27.94,16.51 38.1,16.51 v38.1,15.24 | v92.71,15.24 92.71,16.51 v93.98,16.51 | v143.51,16.51 153.67,16.51 154.94,17.78 154.94,38.1 LED1.A
RAM_SEL  (via drill 0.6 pad 1.42)
  Top 0.406: v44.45,20.32 v55.88,20.32 | v73.66,20.32 v82.55,20.32
  Bottom 0.406: IC1.18 38.1,31.75 36.83,30.48 36.83,20.32 v44.45,20.32 | v55.88,20.32 v73.66,20.32 | v82.55,20.32 82.55,27.94 91.44,27.94 91.44,38.1 92.71,40.64 IC2.20
RAM_WR  (via drill 0.6 pad 1.42)
  Top 0.406: v48.26,22.86 v55.88,22.86 | v72.39,21.59 v91.44,21.59 | v93.98,21.59 v110.49,21.59
  Bottom 0.406: IC1.19 43.18,29.21 48.26,24.13 v48.26,22.86 | v55.88,22.86 58.42,22.86 59.69,21.59 66.04,21.59 68.58,21.59 v72.39,21.59 | JP5.12 90.17,21.59 v91.44,21.59 92.71,21.59 v93.98,21.59 | v110.49,21.59 IC2.27
SD_SEL  (via drill 0.6 pad 1.42)
  Top 0.406: v46.99,17.78 v55.88,17.78 | v64.77,5.08 v76.2,5.08 | v123.19,2.54 v123.19,10.16
  Bottom 0.406: IC1.20 40.64,22.86 45.72,22.86 46.99,21.59 v46.99,17.78 | v55.88,17.78 59.69,17.78 59.69,5.08 v64.77,5.08 | v76.2,5.08 77.47,5.08 81.28,1.27 123.19,1.27 v123.19,2.54 | v123.19,10.16 SV1.1
SDR_LED  (via drill 0.6 pad 1.42)
  Top 0.406: v133.35,24.13 v127,24.13 | v59.69,24.13 v34.29,24.13 | v31.75,43.18 v31.75,62.23 | v71.12,26.67 v86.36,26.67 | v86.36,24.13 v113.03,24.13
  Bottom 0.406: LED3.A 152.4,24.13 v133.35,24.13 | v127,24.13 v113.03,24.13 | v71.12,26.67 68.58,26.67 68.58,27.94 66.04,27.94 64.77,24.13 v59.69,24.13 | v34.29,24.13 34.29,34.29 35.56,35.56 33.02,38.1 33.02,39.37 31.75,41.91 v31.75,43.18 | v31.75,62.23 31.75,69.85 IC1.3 | v86.36,26.67 v86.36,24.13
SDW_LED  (via drill 0.6 pad 1.42)
  Top 0.406: v133.35,33.02 v127,33.02 | v115.57,31.75 v93.98,31.75 | v88.9,16.51 v62.23,16.51 | v58.42,19.05 v41.91,19.05 | v29.21,41.91 v29.21,72.39 | v93.98,25.4 v93.98,29.21
  Bottom 0.406: LED2.A 152.4,33.02 v133.35,33.02 | v127,33.02 118.11,33.02 v115.57,31.75 | v93.98,25.4 88.9,25.4 v88.9,16.51 | v62.23,16.51 60.96,19.05 v58.42,19.05 | v41.91,19.05 30.48,19.05 30.48,40.64 v29.21,41.91 | v29.21,72.39 IC1.2 | v93.98,29.21 v93.98,31.75
SND  (via drill 0.6 pad 1.42)
  Top 0.406: v63.5,26.67 v63.5,91.44
  Bottom 0.406: IC1.21 v63.5,26.67 | v63.5,91.44 59.69,91.44 JP4.1
VCC  (via drill 0.6 pad 1.42)
  Top 0.406: v33.02,82.55 v33.02,50.8
  Bottom 0.33: IC1.30 53.34,52.07 IC1.10 39.37,50.8 v33.02,50.8 8.89,50.8 R1.2 7.62,36.83 8.89,36.83 | C1.+ 8.89,36.83 | 44.45,8.89 34.29,8.89 34.29,11.43 34.29,13.97 16.51,13.97 13.97,16.51 D1.C QG1.4 8.89,21.59 8.89,36.83 | JP5.1 69.85,2.54 46.99,2.54 44.45,5.08 44.45,8.89 | 44.45,8.89 X1.5 | IC2.28 115.57,41.91 115.57,63.5 C7.1 114.3,80.01 113.03,81.28 113.03,86.36 | 43.18,90.17 43.18,91.44 IC4.3 | 43.18,90.17 43.18,86.36 C5.1 | 86.36,88.9 IC3.20 | 86.36,88.9 92.71,88.9 C6.1 97.79,86.36 113.03,86.36 | 132.08,87.63 133.35,88.9 IC5.7 | 132.08,87.63 130.81,86.36 | 130.81,86.36 IC5.20 | C8.1 153.67,87.63 132.08,87.63 | 130.81,86.36 113.03,86.36 | 86.36,88.9 52.07,88.9 52.07,90.17 43.18,90.17
  Bottom 0.406: C5.1 v33.02,82.55
VCC/2  (via drill 0.6 pad 1.42)
  Top 0.406: v31.75,87.63 v45.72,87.63 | v48.26,86.36 v53.34,86.36 | v53.34,82.55 v53.34,78.74 | v64.77,58.42 v64.77,50.8 | v74.93,52.07 v125.73,52.07 | v149.86,44.45 v156.21,44.45 | v144.78,6.35 v134.62,6.35
  Bottom 0.33: C2.1 21.59,93.98 30.48,93.98 31.75,92.71 IC4.2
  Bottom 0.406: IC4.2 v31.75,87.63 | v45.72,87.63 45.72,86.36 v48.26,86.36 | v53.34,86.36 v53.34,82.55 | v53.34,78.74 53.34,58.42 v64.77,58.42 | v64.77,50.8 66.04,52.07 v74.93,52.07 | v125.73,52.07 128.27,49.53 134.62,49.53 134.62,44.45 v149.86,44.45 | v156.21,44.45 156.21,6.35 v144.78,6.35 | v134.62,6.35 SV1.4
VID_TX  (via drill 0.6 pad 1.42)
  Top 0.406: v34.29,41.91 v34.29,86.36 | v40.64,88.9 v40.64,97.79 | v123.19,97.79 v123.19,95.25
  Bottom 0.33: IC5.14 115.57,95.25 v123.19,95.25 146.05,95.25 IC5.2
  Bottom 0.406: IC1.15 34.29,39.37 v34.29,41.91 | v34.29,86.36 38.1,86.36 38.1,88.9 39.37,88.9 v40.64,88.9 | v40.64,97.79 v123.19,97.79

### Text on the board
Bottom: CX80-1.1 | 2013 | (c) Calogiuri Enzo Antonio